# Altium schematic sheet Inputs.SchDoc: Isolated Input
size A4; Revision: 1; SheetNumber: 3; SheetTotal: 7; SheetSize: A4
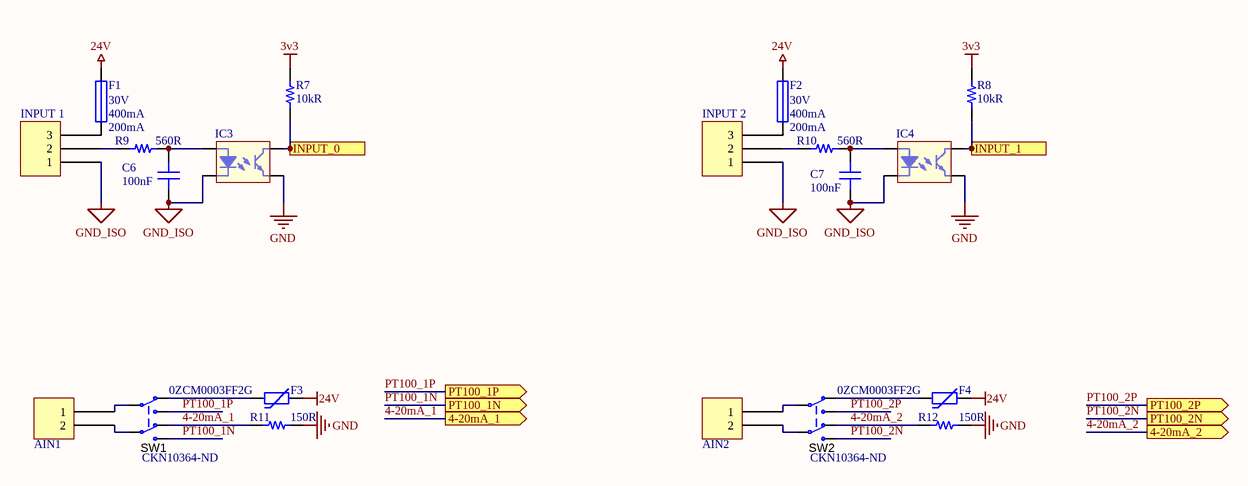
[diagram p0: Inputs.SchDoc]

## Parts
AIN1  2 Pin  [TE 282834-2]  (value not drawn)
AIN2  2 Pin  [TE 282834-2]  (value not drawn)
C6  100nF  [CAP 0603/1608]
C7  100nF  [CAP 0603/1608]
F1  Hold Current: 200mA  Max Voltage Rating (DC): 30V  Trip Current: 400mA  [L_1812]  (hidden comment: 0ZCJ0020FF2E)
F2  Hold Current: 200mA  Max Voltage Rating (DC): 30V  Trip Current: 400mA  [L_1812]  (hidden comment: 0ZCJ0020FF2E)
F3  0ZCM0003FF2G  [NTC 0603_1608]
F4  0ZCM0003FF2G  [NTC 0603_1608]
IC3  EL3H7(B)(TA)-VG  [EL3H7-VG]  (value not drawn)
IC4  EL3H7(B)(TA)-VG  [EL3H7-VG]  (value not drawn)
INPUT_1  (no value)  [TE 282834-3]
INPUT_2  (no value)  [TE 282834-3]
R7  10kR  [RES 0603/1608]
R8  10kR  [RES 0603/1608]
R9  560R  [RES 0603/1608]
R10  560R  [RES 0603/1608]
R11  150R  [RES 0603/1608]
R12  150R  [RES 0603/1608]
SW1  Supplier Part Number 1: CKN10364-ND  [SK-22D01-MG 5 NS]  (hidden comment: SK22D01MG5NS)
SW2  Supplier Part Number 1: CKN10364-ND  [SK-22D01-MG 5 NS]  (hidden comment: SK22D01MG5NS)

## Ports
4-20mA_1 (out), 4-20mA_2 (out), INPUT_0 (out), INPUT_1 (out), PT100_1N (out), PT100_1P (out), PT100_2N (out), PT100_2P (out)

## Nets
3v3: R7.2 R8.2
24V: F1.2 F2.2 F3.2 F4.2
GND: IC3.3 IC4.3 R11.2 R12.2
GND_ISO: C6.1 C7.1 IC3.2 IC4.2 INPUT_1.1 INPUT_2.1
4-20mA_1: R11.1 SW1.3 ; port 4-20mA_1
4-20mA_2: R12.1 SW2.3 ; port 4-20mA_2
INPUT_0: IC3.4 R7.1 ; port INPUT_0
INPUT_1: IC4.4 R8.1 ; port INPUT_1
PT100_1N: SW1.1 ; port PT100_1N
PT100_1P: SW1.4 ; port PT100_1P
PT100_2N: SW2.1 ; port PT100_2N
PT100_2P: SW2.4 ; port PT100_2P
NetAIN1_1: AIN1.1 SW1.5
NetAIN1_2: AIN1.2 SW1.2
NetAIN2_1: AIN2.1 SW2.5
NetAIN2_2: AIN2.2 SW2.2
NetC6_2: C6.2 IC3.1 R9.2
NetC7_2: C7.2 IC4.1 R10.2
NetF1_1: F1.1 INPUT_1.3
NetF2_1: F2.1 INPUT_2.3
NetF3_1: F3.1 SW1.6
NetF4_1: F4.1 SW2.6
NetINPUT_1_2: INPUT_1.2 R9.1
NetINPUT_2_2: INPUT_2.2 R10.1

## Notes on the sheet
- Title:
- Size:
- Project:
- Revision:
- Sheet
- of
- Date:
- YıLDıZ IoT
- Elperek Mahallesi
- Saray Sokak, No:12
- SAKARYA / TURKEY
- File:

## Library data of the parts
AIN1 AIN2 = 2 Pin: Manufacturer: TE Connectivity; Manufacturer Part Number: 282834-2; Plating: Brass,Steel; Max Supply Voltage (AC): 150V; Number of Contacts: 2; Closed End: No (Without); Max Current Rating: 10A; Connector Type: Receptacle; Screwless Terminal Block: Yes (With); Gender: Male; Number of Levels: 1; Tail Length: 3.4mm; Wire Gauge (Max): 30AWG; Pitch: 2.54mm; Thread Size: M1.6; Approvals: UL; Supplier 1: Digi-Key; Supplier Part Number 1: A98333-ND; Stock 1: 19973; Pricing 1: 1 = 0,89000, 10 = 0,62600, 25 = 0,58360, 50 = 0,52980, 100 = 0,52740, 250 = 0,44536, 500 = 0,42192, 1000 = 0,37504, 5000 = 0,35160 (USD); RoHS: Yes; Mount: Through Hole; Material: Nylon; Housing Color: Green; Contact Plating: Tin; Contact Material: Brass; Color: Green; Housing Material: Polyamide; Min Operating Temperature: -40°C; Max Operating Temperature: 105°C; Number of Circuits: 2; Interlock: No (Without); Screw Flange: No (Without); Side Stackable: Yes (With); Orientation: Straight; Number of Rows: 1; Max Voltage Rating (AC): 150V; Number of Poles: 2; Current Rating: 10A; Voltage Rating: 150V; Package Quantity: 300; Packaging: Bulk; Number of Positions: 2; Termination: Solder; Number of Positions Per Level: 2; Current: 10A; Voltage: 150V; Length: 5.54mm; Depth: 6.5mm; Wire Gauge (Min): 30AWG; Width: 6.5mm; Wire/Cable Gauge: 30AWG; Radiation Hardening: No; ELV: Compliant; Lead Free: Lead Free; REACH SVHC: Unknown; Flammability Rating: UL94 V-0; ComponentLink1URL: https://datasheet.ciiva.com/11758/0900766b80e7dc96-11758675.pdf?src-supplier=RSComponents; ComponentLink1Description: https://datasheet.ciiva.com/11758/0900766b80e7dc96-11758675.pdf?src-supplier=RSComponents; ComponentLink2URL: https://datasheet.ciiva.com/16386/282834-2-16386363.pdf?src-supplier=Future+Electronics; ComponentLink2Description: https://datasheet.ciiva.com/16386/282834-2-16386363.pdf?src-supplier=Future+Electronics; ComponentLink3URL: https://datasheet.ciiva.com/14609/70086732-14609670.pdf?src-supplier=Allied+Electronics; ComponentLink3Description: https://datasheet.ciiva.com/14609/70086732-14609670.pdf?src-supplier=Allied+Electronics; ComponentLink4URL: https://datasheet.ciiva.com/15169/getdatasheetpartid-155864-15169558.pdf?src-supplier=Verical; ComponentLink4Description: https://datasheet.ciiva.com/15169/getdatasheetpartid-155864-15169558.pdf?src-supplier=Verical; ComponentLink5URL: https://datasheet.ciiva.com/3141/eng-cs-1308389-eurostyle-terminal-blocks-0607-3141115.pdf?src-supplier=Avnet; ComponentLink5Description: https://datasheet.ciiva.com/3141/eng-cs-1308389-eurostyle-terminal-blocks-0607-3141115.pdf?src-supplier=Avnet; ComponentLink6URL: https://datasheet.ciiva.com/823/eng-cd-282834-c1-823453.pdf?src-supplier=Digi-Key; ComponentLink6Description: https://datasheet.ciiva.com/823/eng-cd-282834-c1-823453.pdf?src-supplier=Digi-Key; ComponentLink7URL: https://datasheet.ciiva.com/16676/eng-cs-1308389-eurostyle-terminal-blocks-0607-16676126.pdf?src-supplier=Avnet+Europe; ComponentLink7Description: https://datasheet.ciiva.com/16676/eng-cs-1308389-eurostyle-terminal-blocks-0607-16676126.pdf?src-supplier=Avnet+Europe; ComponentLink8URL: https://datasheet.ciiva.com/30166/eng-cs-1308389-eurostyle-terminal-blocks-0607-30166974.pdf?src-supplier=Onlinecomponents.com; ComponentLink8Description: https://datasheet.ciiva.com/30166/eng-cs-1308389-eurostyle-terminal-blocks-0607-30166974.pdf?src-supplier=Onlinecomponents.com
C6 C7 = Capacitor - Ceramic: Ceramic, SMT Capacitor; Manufacturer: Samsung; Manufacturer Part Number: CL10B104JB8NNNC; Tolerance: 5%; Voltage Rating: 50V; Dielectric: X7R; Supplier 1: Digi-Key; Supplier Part Number 1: 1276-1033-1-ND; Stock 1: 223594; Pricing 1: 1 = 0,10000, 10 = 0,05300, 100 = 0,02350, 500 = 0,01680, 1000 = 0,01320 (USD); RoHS: Yes; Mount: Surface Mount; Case/Package: 0603; Case Code (Metric): 1608; Case Code (Imperial): 0603; Material: Ceramic; Contact Plating: Tin; Min Operating Temperature: -55°C; Max Operating Temperature: 125°C; Packaging: Tape and Reel; Package Quantity: 1; Capacitance: 100nF; Voltage: 50V; Length: 1.6mm; Height: 0.8mm; Width: 0.031inch; Thickness: 0.035inch; Depth: 0.8mm; Radiation Hardening: No; ComponentLink1URL: https://media.digikey.com/pdf/Data%20Sheets/Samsung%20PDFs/CL_Series_MLCC_ds.pdf?src-supplier=Digi-Key; ComponentLink1Description: https://media.digikey.com/pdf/Data%20Sheets/Samsung%20PDFs/CL_Series_MLCC_ds.pdf?src-supplier=Digi-Key; ComponentLink2URL: https://www.verical.com/server-webapp/html/getDatasheet?partID=359321&src-supplier=Verical; ComponentLink2Description: https://www.verical.com/server-webapp/html/getDatasheet?partID=359321&src-supplier=Verical; ComponentLink3URL: http://www1.futureelectronics.com/doc/SAMSUNG/CL10B104JB8NNNC.pdf?src-supplier=Future+Electronics; ComponentLink3Description: http://www1.futureelectronics.com/doc/SAMSUNG/CL10B104JB8NNNC.pdf?src-supplier=Future+Electronics; ComponentLink4URL: https://produktinfo.conrad.com/datenblaetter/450000-474999/456613-da-01-en-VS_KONDENSATOR_0603.pdf?src-supplier=Conrad; ComponentLink4Description: https://produktinfo.conrad.com/datenblaetter/450000-474999/456613-da-01-en-VS_KONDENSATOR_0603.pdf?src-supplier=Conrad
F1 F2 = Fuse 1: Fuse; Manufacturer: Bel; Max Current Rating: 10A; Power Dissipation: 400mW; Time to Trip: 0.1s; Approvals: TUV,UL; ComponentLink2Description: SMD; ComponentLink3Description: ESIMF110/16-2; Supplier 1: Digi-Key; Supplier Part Number 1: 507-1797-1-ND; Manufacturer Part Number: 0ZCJ0020FF2E; Stock 1: 381173; Pricing 1: 1 = 0,13000, 5 = 0,13000, 10 = 0,12500, 50 = 0,11140, 100 = 0,10370, 250 = 0,09216, 500 = 0,07680, 1000 = 0,07296 (USD); RoHS: Yes; Mount: Surface Mount; Case/Package: 1206; Case Code (Metric): 3216; Case Code (Imperial): 1206; Contact Plating: Matte,Tin; Number of Terminals: 2; Min Operating Temperature: -40°C; Max Operating Temperature: 85°C; Package Quantity: 3000; Packaging: Cut Tape; Lead Free: Lead Free; ComponentLink1URL: https://www.belfuse.com/resources/CircuitProtection/datasheets/0ZCJ%20Nov2016.pdf; ComponentLink1Description: https://www.belfuse.com/resources/CircuitProtection/datasheets/0ZCJ%20Nov2016.pdf; Price: 0,13
F3 F4 = ERT-J1VK102JM: THERM NTC 0603 (FOR AUTOMOTIVE); Manufacturer: Bel; ComponentLink1Description: Datasheet; ComponentLink1URL: https://industrial.panasonic.com/cdbs/www-data/pdf/AUA0000/AUA0000C11.pdf; ComponentLink2Description: DigiKey Link; ComponentLink2URL: http://digikey.com/product-detail/en/panasonic-electronic-components/ERT-J1VK102JM/P123690DKR-ND/9351505; Supplier 1: Digi-Key; Supplier Part Number 1: 507-0ZCM0003FF2GCT-ND; Manufacturer Part Number: 0ZCM0003FF2G; Stock 1: 12; Pricing 1: 1 = 0,16000, 5 = 0,16000, 10 = 0,15200, 50 = 0,13580, 100 = 0,12640, 250 = 0,11232, 500 = 0,09360, 1000 = 0,08892 (USD); RoHS: No
IC3 IC4 = Optoisolator: Manufacturer: Everlight; Number of Channels: 1; Collector Emitter Voltage (VCEO): 80V; Max Power Dissipation: 200mW; Forward Current: 50mA; Forward Voltage: 1.4V; Reverse Breakdown Voltage: 6V; Rise Time: 18000ns; Collector Emitter Saturation Voltage: 200mV; Isolation Voltage: 3.75kV; Current Transfer Ratio: 260%; Approvals: UL; Supplier 1: Digi-Key; Supplier Part Number 1: 1080-1197-1-ND; Manufacturer Part Number: EL3H7(B)(TA)-VG; Stock 1: 29823; Pricing 1: 1 = 0,50000, 10 = 0,35500, 100 = 0,20730, 500 = 0,14212, 1000 = 0,11844, 2500 = 0,10660 (USD); RoHS: Yes; Mount: Surface Mount; Case/Package: SSOP; Number of Pins: 4; Min Operating Temperature: -55°C; Max Operating Temperature: 125°C; Packaging: Tape and Reel; Package Quantity: 1; Max Output Voltage: 80V; Output Current per Channel: 50mA; Max Input Current: 50mA; Max Collector Current: 50mA; Fall Time: 18000ns; Number of Elements: 1; Power Dissipation: 200mW; Collector Emitter Breakdown Voltage: 80V; Radiation Hardening: No; Lead Free: Lead Free; ComponentLink1URL: https://datasheet.ciiva.com/2086/el3h7-g-series-2086501.pdf?src-supplier=Digi-Key; ComponentLink1Description: https://datasheet.ciiva.com/2086/el3h7-g-series-2086501.pdf?src-supplier=Digi-Key; ComponentLink2URL: https://datasheet.ciiva.com/2086/el3h7-g-series-2086502.pdf?src-supplier=Digi-Key; ComponentLink2Description: https://datasheet.ciiva.com/2086/el3h7-g-series-2086502.pdf?src-supplier=Digi-Key; ComponentLink3URL: https://datasheet.ciiva.com/2086/el3h7-g-series-2086503.pdf?src-supplier=Digi-Key; ComponentLink3Description: https://datasheet.ciiva.com/2086/el3h7-g-series-2086503.pdf?src-supplier=Digi-Key; ComponentLink4URL: https://datasheet.ciiva.com/15209/getdatasheetpartid-416716-15209115.pdf?src-supplier=Verical; ComponentLink4Description: https://datasheet.ciiva.com/15209/getdatasheetpartid-416716-15209115.pdf?src-supplier=Verical
INPUT_1 INPUT_2 = 3 Pin: TERM BLOCK HDR 3POS R/A 3.81MM; Manufacturer: On-Shore Technology; Manufacturer Part Number: OSTVN03A150; Plating: Brass,Steel; Number of Levels: 1; Number of Positions Per Level: 3; Current: 6A; Voltage: 125V; Pitch: 0.1inch; Wire Gauge (Max): 30AWG; Wire Gauge (Min): 20AWG; ComponentLink1Description: Datasheet; ComponentLink1URL: http://portal.fciconnect.com/Comergent//fci/drawing/20020110.pdf; ComponentLink2Description: Digi-Key Listing; ComponentLink2URL: http://www.digikey.ca/product-detail/en/20020110-D031A01LF/609-3820-ND/2261261; Supplier 1: Digi-Key; Supplier Part Number 1: ED10562-ND; Stock 1: 6258; Pricing 1: 1 = 1,03000, 10 = 0,72600, 25 = 0,67720, 50 = 0,61480, 100 = 0,61200, 250 = 0,51680, 500 = 0,48960, 1000 = 0,43520, 5000 = 0,35360 (USD); RoHS: Yes; Mount: Through Hole; Number of Pins: 3; Housing Material: Thermoplastic; Color: Green; Contact Plating: Brass; Min Operating Temperature: -30°C; Max Operating Temperature: 105°C; Termination: Screw; Packaging: Bulk; ComponentLink3URL: https://datasheet.ciiva.com/825/ostvnxxa150-825196.pdf?src-supplier=Digi-Key; ComponentLink3Description: https://datasheet.ciiva.com/825/ostvnxxa150-825196.pdf?src-supplier=Digi-Key
R7 R8 = Resistor_Chip: Ceramic, SMT Capacitor; Manufacturer: Stackpole Electronics; Manufacturer Part Number: RNCP0603FTD10K0; Tolerance: 1%; Max Power Dissipation: 125mW; Temperature Coefficient: 100ppm/°C; Supplier 1: Digi-Key; Supplier Part Number 1: RNCP0603FTD10K0CT-ND; Stock 1: 183083; Pricing 1: 1 = 0,10000, 10 = 0,06700, 100 = 0,02730, 1000 = 0,01224, 2500 = 0,01063 (USD); RoHS: Yes; Mount: Surface Mount; Case/Package: 0603; Case Code (Metric): 1608; Case Code (Imperial): 0603; Contact Plating: Matte,Tin; Min Operating Temperature: -55°C; Max Operating Temperature: 155°C; Packaging: Tape and Reel; Resistance: 10kR; Composition: Thin Film; Number of Terminations: 2; Features: Anti-Sulfur,Moisture Resistant; Length: 0.059inch; Height: 0.02inch; Width: 0.031inch; Radiation Hardening: No; Lead Free: Lead Free
R9 R10 = Resistor_Chip: Ceramic, SMT Capacitor; Manufacturer: Rohm; Manufacturer Part Number: ESR03EZPJ561; Tolerance: 5%; Temperature Coefficient: 200ppm/°C; Max Power Dissipation: 250mW; Supplier 1: Digi-Key; Supplier Part Number 1: RHM560DCT-ND; Stock 1: 14494; Pricing 1: 1 = 0,10000, 10 = 0,08700, 100 = 0,03330, 1000 = 0,01464, 2500 = 0,01264 (USD); RoHS: Yes; Case/Package: 0603; Case Code (Metric): 1608; Case Code (Imperial): 0603; Min Operating Temperature: -55°C; Max Operating Temperature: 155°C; Package Quantity: 1; Resistance: 560R; Packaging: Tape and Reel; Composition: Thick Film; Number of Terminations: 2; Features: Automotive AEC-Q200; Length: 0.063inch; Height: 0.022inch; Width: 0.031inch; ComponentLink1URL: http://www.rohm.com/web/global/datasheet/ESR01MZPF/esr-e; ComponentLink1Description: http://www.rohm.com/web/global/datasheet/ESR01MZPF/esr-e; ComponentLink2URL: https://www.rohm.com/datasheet/ESR01MZPF/esr-e; ComponentLink2Description: https://www.rohm.com/datasheet/ESR01MZPF/esr-e
R11 R12 = Resistor_Chip: Ceramic, SMT Capacitor; Manufacturer: Yageo; Manufacturer Part Number: RC0603FR-07150RL; Temperature Coefficient: 100ppm/°C; Tolerance: 1%; Voltage Rating (DC): 50V; Power Rating: 100mW; Supplier 1: Digi-Key; Supplier Part Number 1: 311-150HRCT-ND; Stock 1: 2591507; Pricing 1: 1 = 0,10000, 10 = 0,02300, 100 = 0,00940, 1000 = 0,00421, 2500 = 0,00366 (USD); RoHS: Yes; Case/Package: 0603; Number of Pins: 2; Case Code (Imperial): 0603; Case Code (Metric): 1608; Min Operating Temperature: -55°C; Max Operating Temperature: 155°C; Resistance: 150R; Packaging: Tape and Reel; Composition: Thick Film; Termination: SMD/SMT; Military Standard: Not; Voltage Rating: 50V; Package Quantity: 5000; Length: 1.6mm; Height: 0.45mm; Width: 0.8mm; Depth: 0.8mm; Lead Free: Lead Free; REACH SVHC: No SVHC; ComponentLink1URL: https://datasheet.ciiva.com/46440/1868787-46440893.pdf?src-supplier=Element14; ComponentLink1Description: https://datasheet.ciiva.com/46440/1868787-46440893.pdf?src-supplier=Element14; ComponentLink2URL: https://datasheet.ciiva.com/12555/rc0603-272842-12555301.pdf?src-supplier=Mouser; ComponentLink2Description: https://datasheet.ciiva.com/12555/rc0603-272842-12555301.pdf?src-supplier=Mouser; ComponentLink3URL: https://datasheet.ciiva.com/46412/443971-46412844.pdf?src-supplier=Element14; ComponentLink3Description: https://datasheet.ciiva.com/46412/443971-46412844.pdf?src-supplier=Element14
SW1 SW2 = DPDT Switch: Switch THD right-angle toggle DPDT; Manufacturer: ITT C&K; Actuator Material: PBT,Polybutylene; Actuator Type: Standard; Electrical Life: 10000Cycles; Illumination Type: Non-Illuminated; Current Rating: 300mA; Voltage Rating (DC): 30V; Switch Travel: 2mm; Switch Function: On-On; Actuator Length: 5mm; Supplier 1: Digi-Key; Manufacturer Part Number: SK22D01MG5NS; Stock 1: 4200; Pricing 1: 1 = 0,69000, 10 = 0,66900, 25 = 0,64320, 100 = 0,55820, 250 = 0,50936, 500 = 0,47334, 1000 = 0,42446, 2500 = 0,39874, 5000 = 0,37044 (USD); RoHS: Yes; Mount: Through Hole; Contact Plating: Silver; Termination: PC Pin; Throw Configuration: DPDT; Package Quantity: 1000; Contact Current Rating: 300mA; Packaging: Bulk; ComponentLink1URL: https://datasheet.ciiva.com/5279/sk-22d01-mg-190328-5279988.pdf?src-supplier=Mouser; ComponentLink1Description: https://datasheet.ciiva.com/5279/sk-22d01-mg-190328-5279988.pdf?src-supplier=Mouser; ComponentLink2URL: https://datasheet.ciiva.com/2889/sk-22d01-mg-2889186.pdf?src-supplier=Digi-Key; ComponentLink2Description: https://datasheet.ciiva.com/2889/sk-22d01-mg-2889186.pdf?src-supplier=Digi-Key